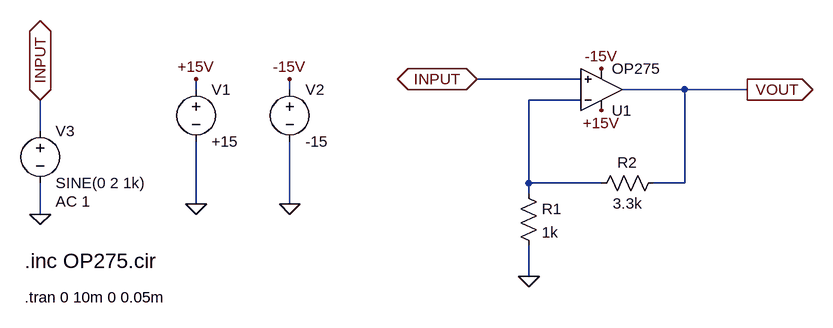
[diagram p0: schematic Non_Invertering Amplifier.asc]
Non_Invertering Amplifier.asc, the LTspice schematic file:
Version 4
SHEET 1 880 680
WIRE 272 96 112 96
WIRE -320 112 -320 96
WIRE -176 112 -176 96
WIRE 432 112 336 112
WIRE 528 112 432 112
WIRE 272 128 192 128
WIRE -560 176 -560 128
WIRE 192 256 192 128
WIRE 304 256 192 256
WIRE 432 256 432 112
WIRE 432 256 384 256
WIRE 192 272 192 256
WIRE -320 288 -320 192
WIRE -176 288 -176 192
WIRE -560 304 -560 256
WIRE 192 400 192 352
FLAG -320 288 0
FLAG -176 288 0
FLAG -320 96 +15V
FLAG -176 96 -15V
FLAG -560 304 0
FLAG -560 128 INPUT
IOPIN -560 128 BiDir
FLAG 304 80 -15V
FLAG 304 144 +15V
FLAG 192 400 0
FLAG 112 96 INPUT
IOPIN 112 96 BiDir
FLAG 528 112 VOUT
IOPIN 528 112 Out
SYMBOL voltage -320 96 R0
WINDOW 123 0 0 Left 2
WINDOW 39 0 0 Left 2
SYMATTR InstName V1
SYMATTR Value +15
SYMBOL voltage -176 96 R0
WINDOW 123 0 0 Left 2
WINDOW 39 0 0 Left 2
SYMATTR InstName V2
SYMATTR Value -15
SYMBOL voltage -560 160 R0
WINDOW 123 24 124 Left 2
WINDOW 39 0 0 Left 2
SYMATTR Value2 AC 1
SYMATTR InstName V3
SYMATTR Value SINE(0 2 1k)
SYMBOL opamp2 304 176 M180
SYMATTR InstName U1
SYMATTR Value OP275
SYMBOL res 176 256 R0
SYMATTR InstName R1
SYMATTR Value 1k
SYMBOL res 400 240 R90
WINDOW 0 0 56 VBottom 2
WINDOW 3 32 56 VTop 2
SYMATTR InstName R2
SYMATTR Value 3.3k
TEXT -584 376 Left 3 !.inc OP275.cir
TEXT -584 432 Left 2 !.tran 0 10m 0 0.05m

The netlist it stands for:
* Non_Invertering Amplifier.asc
V1 +15V 0 +15
V2 -15V 0 -15
V3 INPUT 0 SINE(0 2 1k) AC 1
XU1 INPUT N001 +15V -15V VOUT OP275  ; pins In+ In- V+ V- OUT
R1 N001 0 1k
R2 VOUT N001 3.3k
.inc OP275.cir
.tran 0 10m 0 0.05m
.backanno
.end